# EAGLE schematic relief_robot (EAGLE 6.4)
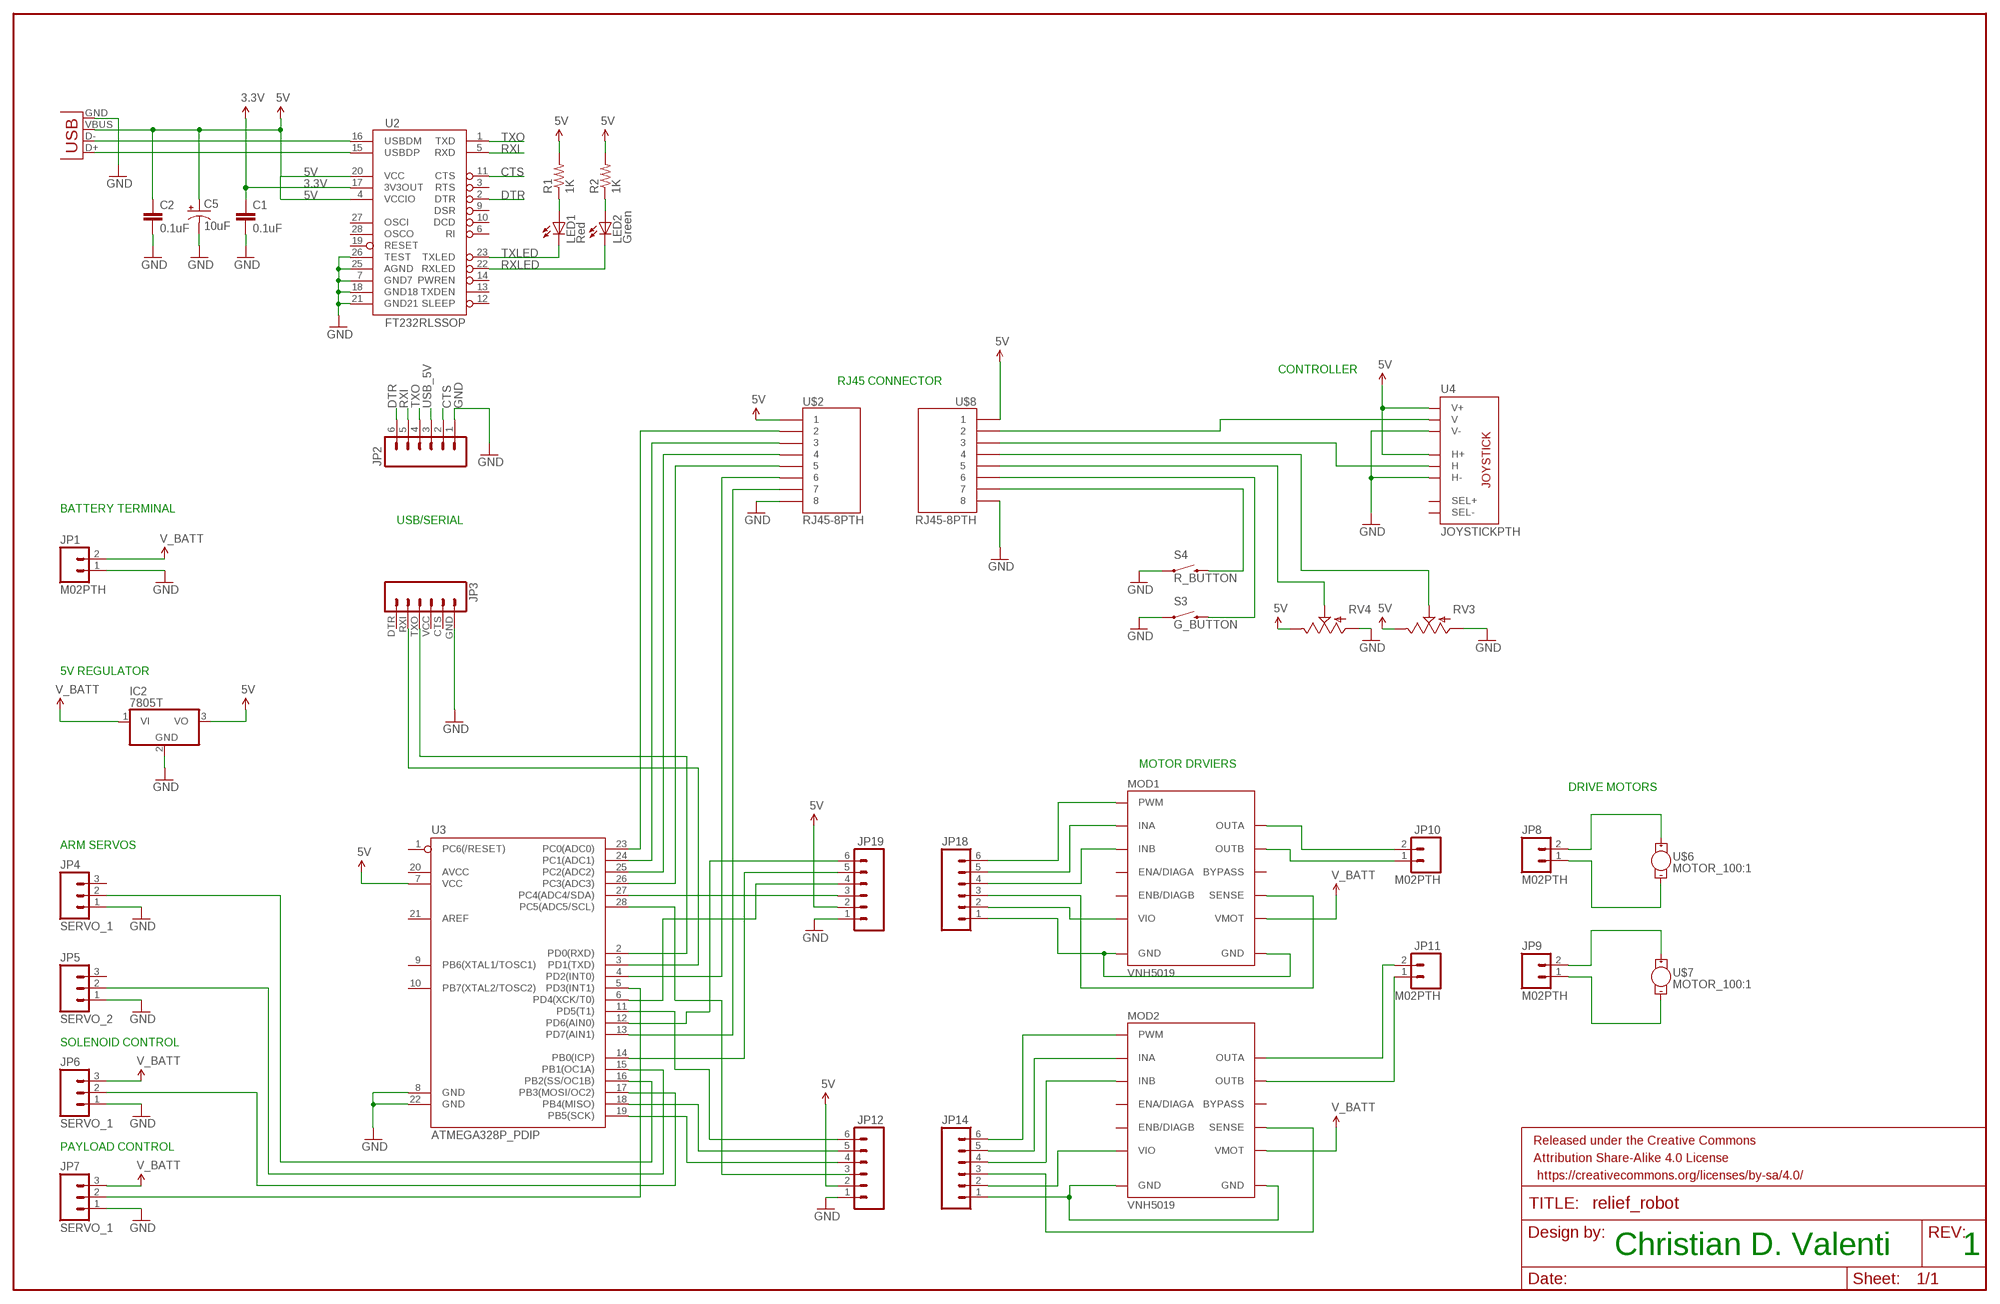
[diagram p0: schematic, sheet 1]

## Parts
C1  0.1uF  CAP0402-CAP  [0402-CAP]
C2  0.1uF  CAP0402-CAP  [0402-CAP]
C5  10uF  CAP_POL1206  [EIA3216]
FRAME1  FRAME-LEDGER  [CREATIVE_COMMONS]
IC2  7805T  [TO220H]
JP1  M02PTH  [1X02]
JP2  M06SMD-FEMALE-V2  [1X06-SMD-FEMALE-V2]
JP3  M06SIP  [1X06]
JP4  SERVO_1  M03PTH  [1X03]
JP5  SERVO_2  M03PTH  [1X03]
JP6  SERVO_1  M03PTH  [1X03]
JP7  SERVO_1  M03PTH  [1X03]
JP8  M02PTH  [1X02]
JP9  M02PTH  [1X02]
JP10  M02PTH  [1X02]
JP11  M02PTH  [1X02]
JP12  M06RA  [MOLEX-1X6-RA]
JP14  M06RA  [MOLEX-1X6-RA]
JP18  M06RA  [MOLEX-1X6-RA]
JP19  M06RA  [MOLEX-1X6-RA]
LED1  Red  LED0603  [LED-0603]
LED2  Green  LED0603  [LED-0603]
MOD1  VNH5019  POLOLU_VNH2SP30-MD01B-U  [POLOLU_MD01B_U]
MOD2  VNH5019  POLOLU_VNH2SP30-MD01B-U  [POLOLU_MD01B_U]
R1  1K  RESISTOR0402-RES  [0402-RES]
R2  1K  RESISTOR0402-RES  [0402-RES]
RV3  POTMAM  [POT_MAMMOTH]
RV4  POTMAM  [POT_MAMMOTH]
S3  G_BUTTON  SWITCH-MOMENTARY-2SIDE_EZ  [TACTILE-PTH-SIDEEZ]
S4  R_BUTTON  SWITCH-MOMENTARY-2SIDE_EZ  [TACTILE-PTH-SIDEEZ]
U2  FT232RLSSOP  [SSOP28DB]
U3  ATMEGA328P_PDIP  [DIL28-3]
U4  JOYSTICKPTH  [JOYSTICK]
U$2  RJ45-8PTH  [RJ45-8]
U$6  MOTOR_100:1  MOTOR10MM  [VIBE-MOTOR-10MM]
U$7  MOTOR_100:1  MOTOR10MM  [VIBE-MOTOR-10MM]
U$8  RJ45-8PTH  [RJ45-8]
X2  USB-SMD-NS  [USB-MINIB-NOSTOP]

## Nets
3.3V [power]: C1.1 U2.17(3V3OUT)
5V: C2.1 C5.A(+) IC2.3(VO) JP12.2 JP19.2 R1.2 R2.2 RV3.P$3(E) RV4.P$3(E) U2.4(VCCIO) U2.20(VCC) U3.7(VCC) U4.H1(H+) U4.V1(V+) U$2.1 U$8.1 X2.VBUS
CTS: JP2.2 U2.11(CTS)
DTR: JP2.6 U2.2(DTR)
GND: C1.2 C2.2 C5.C(-) IC2.2(GND) JP1.1 JP2.1 JP3.GND JP4.1 JP5.1 JP6.1 JP7.1 JP12.1 JP19.1 RV3.P$2(A) RV4.P$2(A) S3.1 S4.1 U2.7(GND7) U2.18(GND18) U2.21(GND21) U2.25(AGND) U2.26(TEST) U3.8(GND) U3.22(GND) U4.H3(H-) U4.V3(V-) U$2.8 U$8.8 X2.GND
N$1: JP18.2 MOD1.VIO
N$2: JP14.2 MOD2.VIO
N$3: JP18.1 MOD1.GND1(GND) MOD1.GND2(GND)
N$4: JP14.1 MOD2.GND1(GND) MOD2.GND2(GND)
N$5: JP12.3
N$6: JP6.2 U3.17(PB3(MOSI/OC2))
N$7: LED1.A R1.1
N$8: LED2.A R2.1
N$9: JP19.6 U3.12(PD6(AIN0))
N$10: JP3.TXO U3.2(PD0(RXD))
N$11: JP8.2 U$6.+
N$12: JP8.1 U$6.-
N$13: JP9.2 U$7.+
N$14: JP9.1 U$7.-
N$15: U3.23(PC0(ADC0)) U$2.2
N$16: U3.24(PC1(ADC1)) U$2.3
N$17: U3.25(PC2(ADC2)) U$2.4
N$18: U3.26(PC3(ADC3)) U$2.5
N$19: JP3.RXI U3.3(PD1(TXD))
N$20: JP12.6 U3.11(PD5(T1))
N$21: JP4.2 U3.16(PB2(SS/OC1B))
N$22: JP5.2 U3.15(PB1(OC1A))
N$23: U3.4(PD2(INT0)) U$2.6
N$24: JP7.2 U3.5(PD3(INT1))
N$25: JP19.5 U3.14(PB0(ICP))
N$26: JP12.5 U3.18(PB4(MISO))
N$27: JP19.4 U3.6(PD4(XCK/T0))
N$28: JP12.4 U3.19(PB5(SCK))
N$29: JP19.3 U3.27(PC4(ADC4/SDA))
N$30: U3.28(PC5(ADC5/SCL))
N$31: U3.13(PD7(AIN1)) U$2.7
N$33: JP10.2 MOD1.OUTA1(OUTA)
N$34: JP10.1 MOD1.OUTB
N$35: JP11.2 MOD2.OUTA1(OUTA)
N$36: JP11.1 MOD2.OUTB
N$37: JP18.6 MOD1.PWM
N$38: JP18.5 MOD1.INA
N$39: JP18.4 MOD1.INB
N$40: JP18.3 MOD1.SENSE
N$41: JP14.3 MOD2.SENSE
N$42: JP14.6 MOD2.PWM
N$43: JP14.5 MOD2.INA
N$44: JP14.4 MOD2.INB
N$45: U4.H2(H) U$8.3
N$46: RV3.P$1(S) U$8.4
N$47: RV4.P$1(S) U$8.5
N$48: U4.V2(V) U$8.2
N$49: S4.2 U$8.7
N$50: S3.2 U$8.6
RXI: JP2.5 U2.5(RXD)
RXLED: LED2.C U2.22(RXLED)
TXLED: LED1.C U2.23(TXLED)
TXO: JP2.4 U2.1(TXD)
USB_5V: JP2.3
USB_D+: U2.15(USBDP) X2.D+
USB_D-: U2.16(USBDM) X2.D-
V_BATT: IC2.1(VI) JP1.2 JP6.3 JP7.3 MOD1.VMOT MOD2.VMOT
Unconnected: JP3.CTS JP3.DTR JP3.VCC JP4.3 JP5.3 MOD1.ENA(ENA/DIAGA) MOD1.ENB(ENB/DIAGB) MOD2.ENA(ENA/DIAGA) MOD2.ENB(ENB/DIAGB) U2.3(RTS) U2.6(RI) U2.9(DSR) U2.10(DCD) U2.12(SLEEP) U2.13(TXDEN) U2.14(PWREN) U2.19(RESET) U2.27(OSCI) U2.28(OSCO) U3.1(PC6(/RESET)) U3.9(PB6(XTAL1/TOSC1)) U3.10(PB7(XTAL2/TOSC2)) U3.20(AVCC) U3.21(AREF) U4.B1A(SEL+) U4.B2A(SEL-)

## Notes on the sheet
- CONTROLLER
- RJ45 CONNECTOR
- BATTERY TERMINAL
- USB/SERIAL
- 5V REGULATOR
- MOTOR DRVIERS
- DRIVE MOTORS
- ARM SERVOS
- SOLENOID CONTROL
- PAYLOAD CONTROL
- Christian D. Valenti | 1

## Power pins joined to a net without a drawn wire
BYPASS: MOD1.BYP(BYPASS) MOD2.BYP(BYPASS)

## Library data of the parts
C1 C2 = SparkFun:CAP: Capacitor Standard 0603 ceramic capacitor, and 0.1" leaded capacitor.
C5 = SparkFun:CAP_POL: Capacitor Polarized These are standard SMD and PTH capacitors. Normally 10uF, 47uF, and 100uF in electrolytic and tantalum varieties. Always verify the external diameter of the through hole cap, it varies with capacity, voltage, and manufacturer. The EIA devices should be standard.
FRAME1 = SparkFun-Aesthetics:FRAME-LEDGER: Schematic Frame Standard 11x14 US Ledger frame
IC2 = adafruit:78*: Positive VOLTAGE REGULATOR Added bigger pads to the TO-92 package
JP1 JP8-JP11 = SparkFun-Connectors:M02: Standard 2-pin 0.1" header. Use with - straight break away headers ( PRT-00116) - right angle break away headers (PRT-00553) - swiss pins (PRT-00743) - machine pins (PRT-00117) - female headers (PRT-00115) Molex polarized connector foot print use with: PRT-08233 with associated crimp pins and housings. 2.54_SCREWTERM for use with PRT-10571. 3.5mm Screw Terminal footprints for PRT-08084 5mm Screw Terminal footprints for use with PRT-08432
JP2 = SparkFun:M06: Header 6 Standard 6-pin 0.1" header. Use with straight break away headers (SKU : PRT-00116), right angle break away headers (PRT-00553), swiss pins (PRT-00743), machine pins (PRT-00117), and female headers (PRT-00115). Molex polarized connector foot print use with SKU : PRT-08094 with associated ...
JP3 JP12 JP14 JP18 JP19 = SparkFun-Connectors:M06: Header 6 Standard 6-pin 0.1" header. Use with straight break away headers (SKU : PRT-00116), right angle break away headers (PRT-00553), swiss pins (PRT-00743), machine pins (PRT-00117), and female headers (PRT-00115). Molex polarized connector foot print use with SKU : PRT-08094 with associated ...
JP4-JP7 = SparkFun-Connectors:M03: Header 3 Standard 3-pin 0.1" header. Use with straight break away headers (SKU : PRT-00116), right angle break away headers (PRT-00553), swiss pins (PRT-00743), machine pins (PRT-00117), and female headers (PRT-00115). Molex polarized connector foot print use with SKU : PRT-08232 with associated crimp pins and housings.
LED1 LED2 = SparkFun:LED: LEDs Standard schematic elements and footprints for 5mm, 3mm, 1206, and 0603 sized LEDs. 5mm - Spark Fun Electronics SKU : COM-00529 (and others)
MOD1 MOD2 = _hhn_Pololu:POLOLU_VNH2SP30-MD01B-U: POLOLU VNH2SP30 MD01B Motor Driver Carrier Board With Current Sense Output DEVICE VERSIONS [none]: plated auxilary OUTA connections * -U : non-plated auxilary OUTA connections -X : no symbol-pins for OUTx, BYPASS, VMOT, GND2 (drawing elements only) SOURCE www.pololu.com/ SPECS Operatingg voltage VMOT 5.5 .. 16 V Logic Voltage VIO 5 V typ. MOSFET on-resistance (per leg): 19 mOhm max. Max PWM frequency 20 kHz Current sense 0.13 V/A Over-voltage shutoff 16 V min. / 19 V typ. Logic input high threshold 3.25 V min. Time to overheat at 20 A 35 s Time to overheat at 15 A 150 s Current for infinite run time 14 A Author: Dipl.-Ing. FH Rainer Bayer
R1 R2 = SparkFun:RESISTOR: Resistor Basic schematic elements and footprints for 0603, 1206, and PTH resistors.
RV3 RV4 = SparkFun-Electromechanical:POT
S3 S4 = SparkFun-Electromechanical:SWITCH-MOMENTARY-2: Various NO switches- pushbuttons, reed, etc
U2 = SparkFun:FT232RL: USB UART FT232RL 4th Generation USB UART (USB <-> Serial) Controller. Spark Fun Electronics SKU : COM-00650
U3 = SparkFun-DigitalIC:ATMEGA328P_PDIP: uC used in the Arduino 32kb flash, 1k EEPROM, 2k SRAM This is the through-hole version of this chip.
U4 = adafruit:JOYSTICK: Thumb Joystick Joystick commonly found in PS2 controllers. Two pots and a select switch. Adapted from Sparkfun Library (but for more common 6mm switch sticks)
U$2 U$8 = SparkFun-Connectors:RJ45-8: RJ45 Jack Simple RJ45, 8-pin connection - connector for common Cat5, Cat5e, and Cat6 Ethernet cables. Footprint not yet proven in production. Connector sku is PRT-00643; Breakout PCB sku is BOB-00716.
U$6 U$7 = SparkFun-Electromechanical:MOTOR: Vibration Motor- ROB-08449 Physical dimension and wire connections for this powerful vibration motor. Motor has a self adhesive backing.
X2 = SparkFun:USB: USB Connectors USB-B-PTH is fully proven SKU : PRT-00139 USB-miniB is fully proven SKU : PRT-00587 USB-A-PCB is untested. USB-A-H is throughly reviewed, but untested. Spark Fun Electronics SKU : PRT-00437 USB-B-SMT is throughly reviewed, but untested. Needs silkscreen touching up. USB-A-S has not been used/tested USB-MB-H has not been used/tested

## Net classes
0 default: width 0.203 mm
1 power: width 0.254 mm